# EAGLE schematic RMCPPS1 (EAGLE 7.5.0)
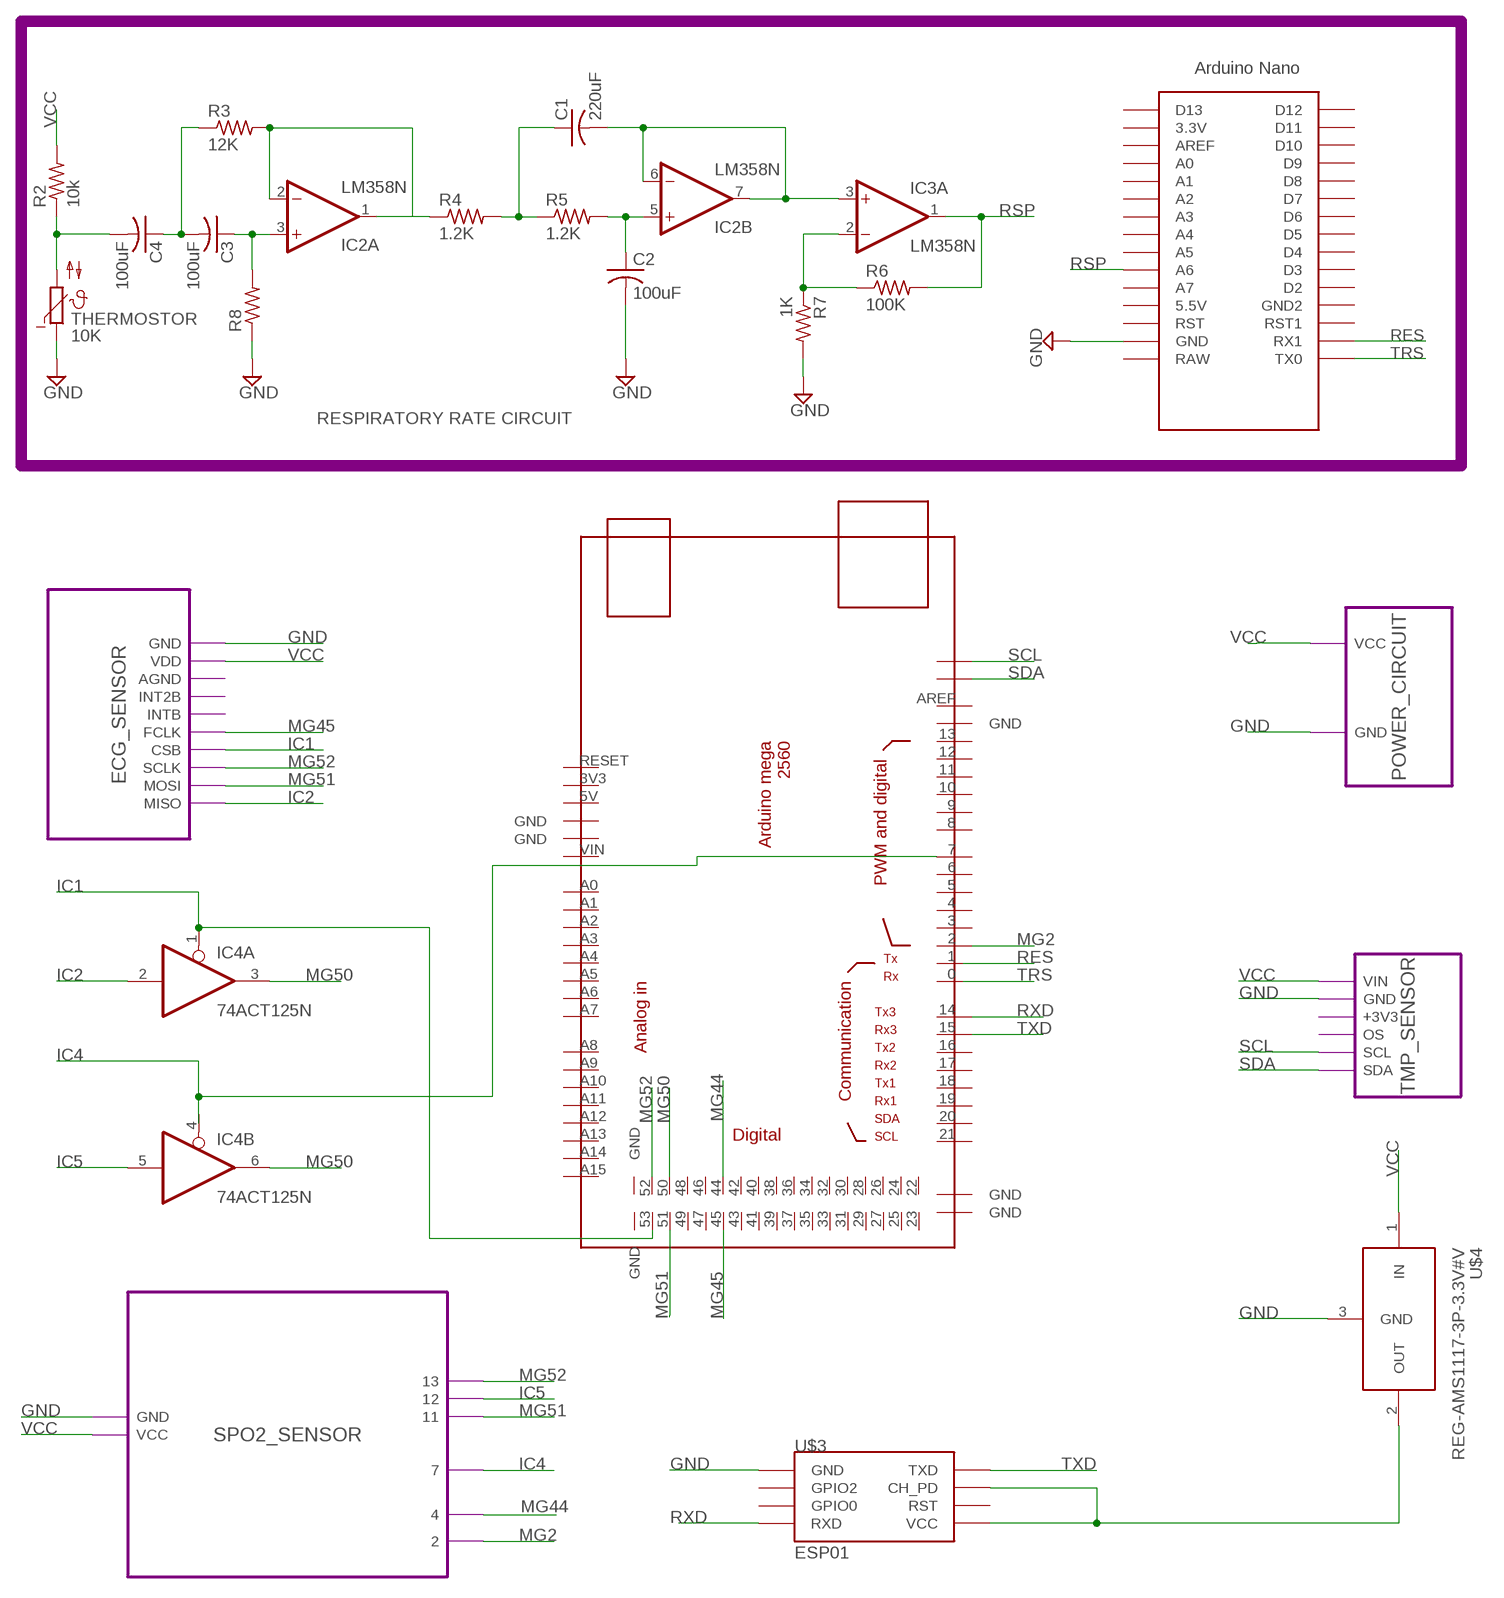
[diagram p0: schematic, sheet 1]

## Parts
C1  220uF  C-US050-024X044  [C050-024X044]
C2  100uF  C-US050-024X044  [C050-024X044]
C3  100uF  C-US050-024X044  [C050-024X044]
C4  100uF  C-US050-024X044  [C050-024X044]
IC2  LM358N  [DIL08]
IC3  LM358N  [DIL08]
IC4  74ACT125N  [DIL14]
R2  10k  R-US_0204/7  [0204/7]
R3  12K  R-US_0204/7  [0204/7]
R4  1.2K  R-US_0204/7  [0204/7]
R5  1.2K  R-US_0204/7  [0204/7]
R6  100K  R-US_0204/7  [0204/7]
R7  1K  R-US_0204/7  [0204/7]
R8  R-US_0204/7  [0204/7]
THERMOSTOR  10K  NTC640-9  [N640]
U$1  NANO  [NANO]
U$2  MEGA_DEVICE  [MEGAOUTLINE]
U$3  ESP01  [ESP01]
U$4  REG-AMS1117-3P-3.3V#V  [REG-AMS1117-3P#V]

## Module instances
ECG_SENSOR = ECG_SENSOR
TMP_SENSOR = TMP_SENSOR
SPO2_SENSOR = SPO2_SENSOR
POWER_CIRCUIT = POWER_CIRCUIT

## Nets
GND: C2.2 R7.2 R8.1 THERMOSTOR.1 U$1.GND U$3.GND U$4.3(GND) ; port TMP_SENSOR.GND POWER_CIRCUIT.GND SPO2_SENSOR.GND
IC1: IC4.1(A:OE)
IC2: IC4.2(A:I) ; port ECG_SENSOR.MISO
IC4: U$2.7 ; port SPO2_SENSOR.7
IC5: IC4.5(B:I) ; port SPO2_SENSOR.12
MG2: port SPO2_SENSOR.2
MG44: port SPO2_SENSOR.4
MG50: IC4.3(A:O) IC4.6(B:O)
MG51: port ECG_SENSOR.MOSI SPO2_SENSOR.11
MG52: port SPO2_SENSOR.13
N$1: C4.2 R2.1 THERMOSTOR.2
N$2: C3.2 C4.1 R3.1
N$3: C3.1 IC2.3(A:+IN) R8.2
N$4: IC2.1(A:OUT) R4.1
N$5: IC2.2(A:-IN) R3.2
N$6: IC3.2(A:-IN) R6.1 R7.1
N$8: C1.1 R4.2 R5.1
N$9: C2.1 IC2.5(B:+IN) R5.2
N$10: C1.2 IC2.6(B:-IN) IC2.7(B:OUT) IC3.3(A:+IN)
N$12: U$3.CH_PD U$3.VCC U$4.2(OUT)
RES: U$1.RX1
RSP: R6.2 U$1.A6
RXD: U$3.RX(RXD)
SCL: port TMP_SENSOR.SCL
SDA: port TMP_SENSOR.SDA
TRS: U$1.TX0
TXD: U$3.TX(TXD)
VCC: R2.2 U$4.1(IN) ; port TMP_SENSOR.VIN POWER_CIRCUIT.VCC SPO2_SENSOR.VCC
Unconnected: IC3.1(A:OUT) IC3.5(B:+IN) IC3.6(B:-IN) IC3.7(B:OUT) IC4.4(B:OE) IC4.8(C:O) IC4.9(C:I) IC4.10(C:OE) IC4.11(D:O) IC4.12(D:I) IC4.13(D:OE) U$1.3.3V U$1.5V(5.5V) U$1.A0 U$1.A1 U$1.A2 U$1.A3 U$1.A4 U$1.A5 U$1.A7 U$1.AREF U$1.D2 U$1.D3 U$1.D4 U$1.D5 U$1.D6 U$1.D7 U$1.D8 U$1.D9 U$1.D10 U$1.D11 U$1.D12 U$1.D13 U$1.GND1(GND2) U$1.ICSP1 U$1.ICSP2 U$1.ICSP3 U$1.ICSP4 U$1.ICSP5 U$1.ICSP6 U$1.RAW U$1.RST U$1.RST1 U$2.0 U$2.1 U$2.2 U$2.3 U$2.3V3 U$2.4 U$2.5 U$2.5V U$2.6 U$2.8 U$2.9 U$2.10 U$2.11 U$2.12 U$2.13 U$2.14 U$2.15 U$2.16 U$2.17 U$2.18 U$2.19 U$2.20 U$2.21 U$2.22 U$2.23 U$2.24 U$2.25 U$2.26 U$2.27 U$2.28 U$2.29 U$2.30 U$2.31 U$2.32 U$2.33 U$2.34 U$2.35 U$2.36 U$2.37 U$2.38 U$2.39 U$2.40 U$2.41 U$2.42 U$2.43 U$2.44 U$2.45 U$2.46 U$2.47 U$2.48 U$2.49 U$2.50 U$2.51 U$2.52 U$2.53 U$2.A0 U$2.A1 U$2.A2 U$2.A3 U$2.A4 U$2.A5 U$2.A6 U$2.A7 U$2.A8 U$2.A9 U$2.A10 U$2.A11 U$2.A12 U$2.A13 U$2.A14 U$2.A15 U$2.AREF U$2.GND@1(GND) U$2.GND@2(GND) U$2.GND@3(GND) U$2.GND@4(GND) U$2.GND@5(GND) U$2.GND@6(GND) U$2.GND@7(GND) U$2.RESET U$2.VIN U$3.GPIO0 U$3.GPIO2 U$3.RST

## Notes on the sheet
- RESPIRATORY RATE CIRCUIT

## Power pins joined to a net without a drawn wire
GND: IC4.7(P:GND)
V+: IC2.8(P:V+) IC3.8(P:V+)
V-: IC2.4(P:V-) IC3.4(P:V-)
VCC: IC4.14(P:VCC)

## Library data of the parts
C1-C4 = adafruit:C-US: CAPACITOR, American symbol
IC2 IC3 = linear:LM358: OP AMP also LM158; LM258; LM2904 Source: http://cache.national.com/ds/LM/LM158.pdf
IC4 = 74xx-eu:74*125: Quad bus BUFFER, 3-state
R2-R8 = adafruit:R-US_: RESISTOR, American symbol
THERMOSTOR = ptc-ntc:NTC640-9: PHILIPS NTC; OC_FARNELL: unknown; OC_NEWARK: unknown
U$1 = Arduino-clone:NANO: Arduino Nano
U$2 = ArduinoMegaOutline:MEGA_DEVICE: mega card as device
U$3 = esp8266modules:ESP01: ESP8266 Wifi module 01
U$4 = diy-modules:REG-AMS1117-3P-*: Linear Regulator based on AMS1117 chip 3-pin version AMS1117 datasheet is available here: http://www.advanced-monolithic.com/pdf/ds1117.pdf Click here to find device on ebay.com <http://www.ebay.com/sch/ams1117+module> Note: There are many variants. Search for the proper version.

## Module ECG_SENSOR
Ports: GND(io) VDD(io) AGND(io) INT2B(io) INTB(io) FCLK(io) CSB(io) SCLK(io) MOSI(io) MISO(io)
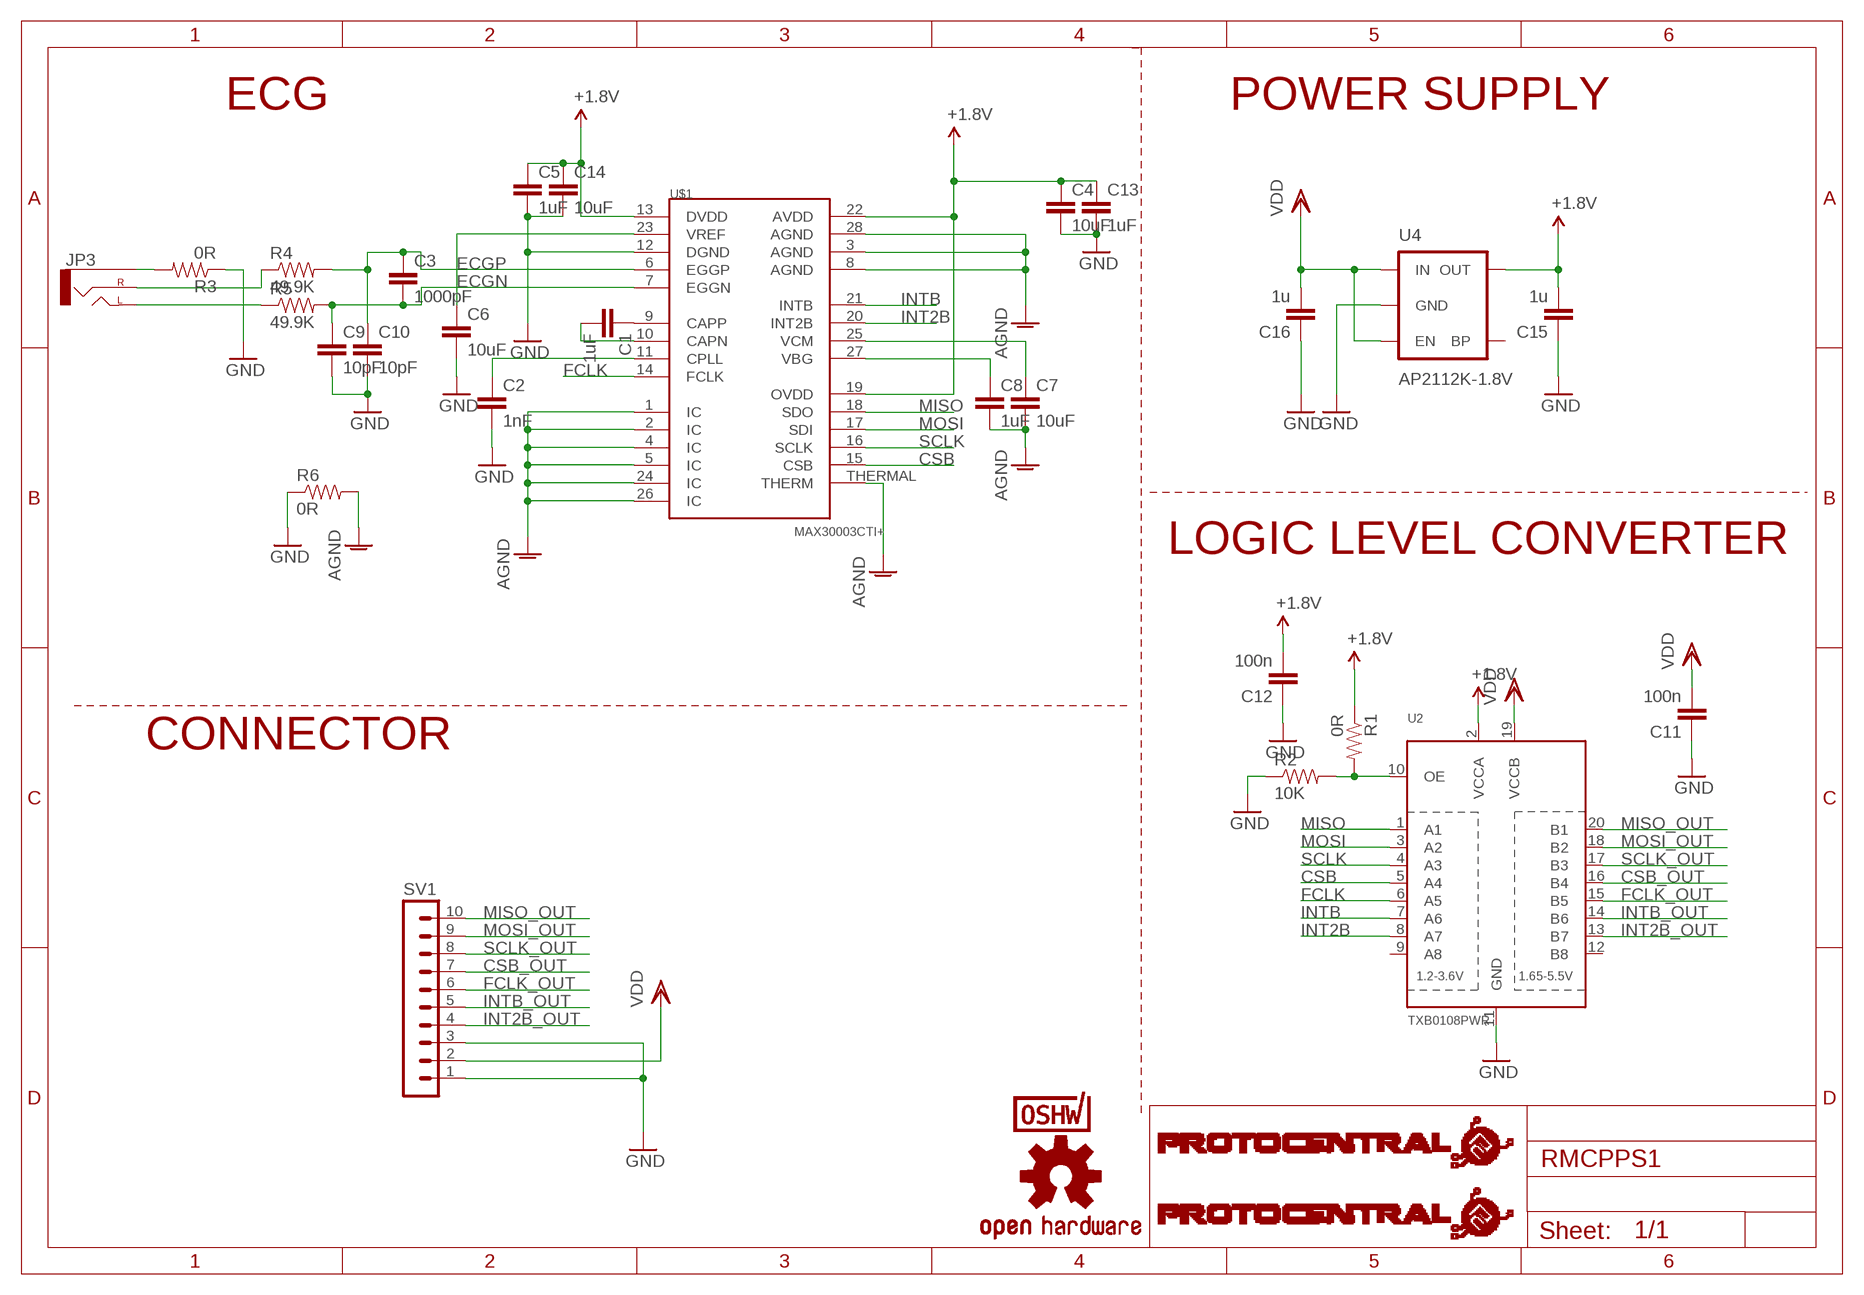
[diagram p1: schematic, module ECG_SENSOR, sheet 1]

### Parts
C1  1uF  C-EUC0805  [C0805]
C2  1nF  C-EUC0805  [C0805]
C3  1000pF  C-EUC0402  [C0402]
C4  10uF  C-EUC0805  [C0805]
C5  1uF  C-EUC0805  [C0805]
C6  10uF  C-EUC0805  [C0805]
C7  10uF  C-EUC0805  [C0805]
C8  1uF  C-EUC0805  [C0805]
C9  10pF  C-EUC0402  [C0402]
C10  10pF  C-EUC0402  [C0402]
C11  100n  C-EUC0402  [C0402]
C12  100n  C-EUC0402  [C0402]
C13  1uF  C-EUC0805  [C0805]
C14  10uF  C-EUC0805  [C0805]
C15  1u  C-EUC0805  [C0805]
C16  1u  C-EUC0805  [C0805]
JP3  AUDIO-JACKSMD2  [AUDIO-JACK-3.5MM-SMD]
R1  0R  RESISTOR0805-RES  [0805]
R2  10K  RESISTOR0805-RES  [0805]
R3  0R  RESISTOR0805-RES  [0805]
R4  49.9K  RESISTOR0805-RES  [0805]
R5  49.9K  RESISTOR0805-RES  [0805]
R6  0R  RESISTOR0805-RES  [0805]
SV1  MA10-1  [MA10-1]
U2  TXB0108PWR  [TSSOP20]
U4  AP2112K-1.8V  V_REG_LDOSMD  [SOT23-5]
U$1  MAX30003CTI+  MAX30003  [QFN-28]
U$2  PROTY_LOGO_WITH_TEXT  [PROTY_WITH_TEXT]
U$3  PROTY-LOGO  [LOGO-PROTY]
U$6  OSHW-LOGOS  [OSHW-LOGO-S]
U$7  CERT-SMALL  [CERT-SMALL-SILK]

### Nets
+1.8V: C4.1 C5.1 C12.2 C13.1 C14.1 C15.2 R1.1 U2.2(VCCA) U4.5(OUT) U$1.13(DVDD) U$1.19(OVDD) U$1.22(AVDD)
AGND: C7.2 C8.2 R6.2 U$1.1(IC) U$1.2(IC) U$1.3(AGND) U$1.4(IC) U$1.5(IC) U$1.8(AGND) U$1.24(IC) U$1.26(IC) U$1.28(AGND) U$1.THERMAL(THERM)
CSB: U2.5(A4) U$1.15(CSB)
CSB_OUT: SV1.7 U2.16(B4)
ECGN: C3.2 C9.1 R5.2 U$1.7(EGGN)
ECGP: C3.1 C10.1 R4.2 U$1.6(EGGP)
FCLK: U2.6(A5) U$1.14(FCLK)
FCLK_OUT: SV1.6 U2.15(B5)
GND: C2.2 C4.2 C5.2 C6.2 C9.2 C10.2 C11.1 C12.1 C13.2 C14.2 C15.1 C16.1 R2.1 R3.1 R6.1 SV1.1 SV1.3 U2.11(GND) U4.2(GND) U$1.12(DGND)
INT2B: U2.8(A7) U$1.20(INT2B)
INT2B_OUT: SV1.4 U2.13(B7)
INTB: U2.7(A6) U$1.21(INTB)
INTB_OUT: SV1.5 U2.14(B6)
MISO: U2.1(A1) U$1.18(SDO)
MISO_OUT: SV1.10 U2.20(B1)
MOSI: U2.3(A2) U$1.17(SDI)
MOSI_OUT: SV1.9 U2.18(B2)
N$1: R1.2 R2.2 U2.10(OE)
N$2: C6.1 U$1.23(VREF)
N$3: C1.1 U$1.9(CAPP)
N$4: JP3.SLEEVE R3.2
N$6: C1.2 U$1.10(CAPN)
N$7: C2.1 U$1.11(CPLL)
N$9: JP3.TIP(LEFT) R5.1
N$10: JP3.RING(RIGHT) R4.1
N$13: C7.1 U$1.25(VCM)
N$14: C8.1 U$1.27(VBG)
SCLK: U2.4(A3) U$1.16(SCLK)
SCLK_OUT: SV1.8 U2.17(B3)
VDD: C11.2 C16.2 SV1.2 U2.19(VCCB) U4.1(IN) U4.3(EN)
Unconnected: U2.9(A8) U2.12(B8) U4.4(BP)

### Notes on the sheet
- ECG | POWER SUPPLY
- LOGIC LEVEL CONVERTER
- CONNECTOR

### Library data of the parts
C1-C16 = rcl:C-EU: CAPACITOR, European symbol
JP3 = SparkFun-Connectors:AUDIO-JACK: 3.5mm Audio Jack Simple 3.5mm common PCB mount audio jack. SKU: PRT-08032; PROD_ID: CONN-10353
R1-R6 = SparkFun:RESISTOR: Resistor Basic schematic elements and footprints for 0603, 1206, and PTH resistors.
SV1 = con-lstb:MA10-1: PIN HEADER; OC_FARNELL: unknown; OC_NEWARK: unknown
U2 = adafruit:TXB0108PWR: 8-Bit Bi-Directional Level Shifter 1.2V-3.6V (VCCA) to 1.65V-5.5V (VCCB) bi-directional level shifter with auto direction sensing. Max data rate - VCCA 1.8V: 20Mbps (50ns), VCCA 3.3V: 100Mbps (10ns) Digikey: 296-21527-1-ND
U4 = SparkFun-PowerIC:V_REG_LDO: Voltage Regulator LDO Standard 150mA LDO voltage regulator in SOT-23 layout. Micrel part MIC5205. BP (by-pass) pin is used to lower output noise with 470pF cap.; PROD_ID: VREG-12457
U$1 = circuitects:MAX30003
U$2 = circuitects:PROTY_LOGO_WITH_TEXT
U$3 = circuitects:PROTY-LOGO
U$6 = SparkFun:OSHW-LOGO: Open Source Hardware Logo This logo indicates the piece of hardware it is found on incorporates a OSHW license and/or adheres to the definition of open source hardware found here: http://freedomdefined.org/OSHW
U$7 = OSHWA:CERT

## Module TMP_SENSOR
Ports: VIN(io) GND(io) +3V3(io) OS(io) SCL(io) SDA(io)
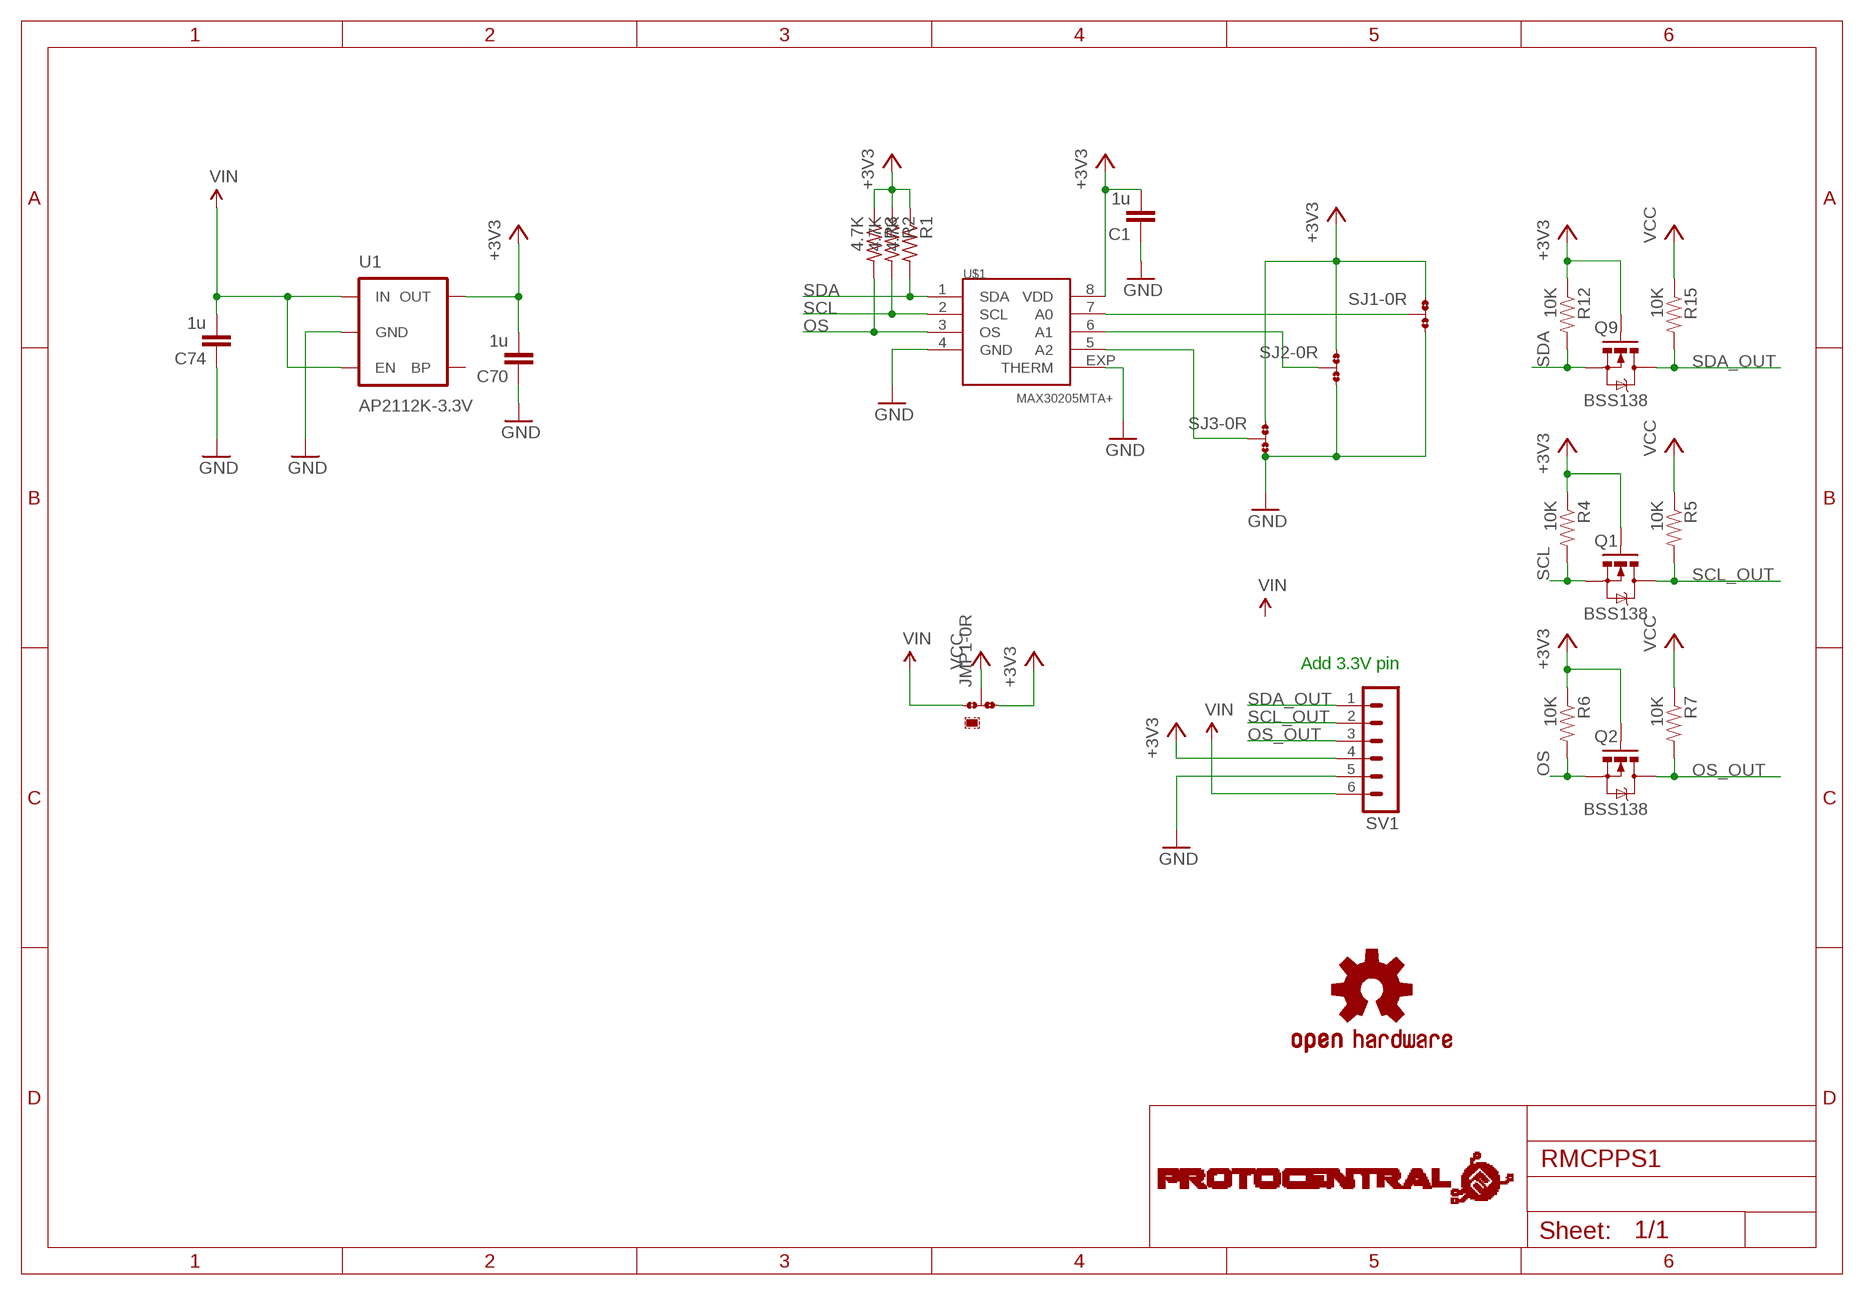
[diagram p2: schematic, module TMP_SENSOR, sheet 1]

### Parts
C1  1u  C-EUC0805  [C0805]
C70  1u  C-EUC0805  [C0805]
C74  1u  C-EUC0805  [C0805]
JMP1  0R-JUMPA  [A0R-JMP-0402]
Q1  BSS138  MOSFET-NCHANNELSMD  [SOT23-3]
Q2  BSS138  MOSFET-NCHANNELSMD  [SOT23-3]
Q9  BSS138  MOSFET-NCHANNELSMD  [SOT23-3]
R1  4.7K  R-US_R0402  [R0402]
R2  4.7K  R-US_R0402  [R0402]
R3  4.7K  R-US_R0402  [R0402]
R4  10K  RESISTOR0805-RES  [0805]
R5  10K  RESISTOR0805-RES  [0805]
R6  10K  RESISTOR0805-RES  [0805]
R7  10K  RESISTOR0805-RES  [0805]
R12  10K  RESISTOR0805-RES  [0805]
R15  10K  RESISTOR0805-RES  [0805]
SJ1  0R-JUMPA  [A0R-JMP-0402]
SJ2  0R-JUMPA  [A0R-JMP-0402]
SJ3  0R-JUMPA  [A0R-JMP-0402]
SV1  MA06-1  [MA06-1]
U1  AP2112K-3.3V  V_REG_LDOSMD  [SOT23-5]
U$1  MAX30205MTA+  [TDFN-08]
U$5  PROTY-LOGO  [LOGO-PROTY]
U$7  OSHW-LOGOS  [OSHW-LOGO-S]

### Nets
+3V3: C1.2 C70.2 JMP1.3 Q1.1(G) Q2.1(G) Q9.1(G) R1.1 R2.1 R3.1 R4.1 R6.1 R12.1 SJ1.1 SJ2.1 SJ3.1 SV1.4 U1.5(OUT) U$1.8(VDD)
A0: SJ1.2 U$1.7(A0)
A1: SJ2.2 U$1.6(A1)
A2: SJ3.2 U$1.5(A2)
GND [gnd]: C1.1 C70.1 C74.1 SJ1.3 SJ2.3 SJ3.3 SV1.5 U1.2(GND) U$1.4(GND) U$1.EXP(THERM)
OS: Q2.2(S) R3.2 R6.2 U$1.3(OS)
OS_OUT: Q2.3(D) R7.2 SV1.3
SCL: Q1.2(S) R2.2 R4.2 U$1.2(SCL)
SCL_OUT: Q1.3(D) R5.2 SV1.2
SDA: Q9.2(S) R1.2 R12.2 U$1.1(SDA)
SDA_OUT: Q9.3(D) R15.2 SV1.1
VCC: JMP1.2 R5.1 R7.1 R15.1
VIN: C74.2 JMP1.1 SV1.6 U1.1(IN) U1.3(EN)
Unconnected: U1.4(BP)

### Notes on the sheet
- Add 3.3V pin

### Library data of the parts
C1 C70 C74 = rcl:C-EU: CAPACITOR, European symbol
JMP1 SJ1-SJ3 = circuitects:0R-JUMP: SMD 0R 0402 Jumper
Q1 Q2 Q9 = SparkFun:MOSFET-NCHANNEL
R1-R3 = rcl:R-US_: RESISTOR, American symbol
R4-R7 R12 R15 = SparkFun:RESISTOR: Resistor Basic schematic elements and footprints for 0603, 1206, and PTH resistors.
SV1 = con-lstb:MA06-1: PIN HEADER; OC_FARNELL: unknown; OC_NEWARK: unknown
U1 = SparkFun-PowerIC:V_REG_LDO: Voltage Regulator LDO Standard 150mA LDO voltage regulator in SOT-23 layout. Micrel part MIC5205. BP (by-pass) pin is used to lower output noise with 470pF cap.; PROD_ID: VREG-12457
U$1 = circuitects:MAX30205
U$5 = circuitects:PROTY-LOGO
U$7 = SparkFun:OSHW-LOGO: Open Source Hardware Logo This logo indicates the piece of hardware it is found on incorporates a OSHW license and/or adheres to the definition of open source hardware found here: http://freedomdefined.org/OSHW

## Module SPO2_SENSOR
Ports: GND(io) VCC(io) 2(io) 7(io) 11(io) 12(io) 13(io) 4(io)
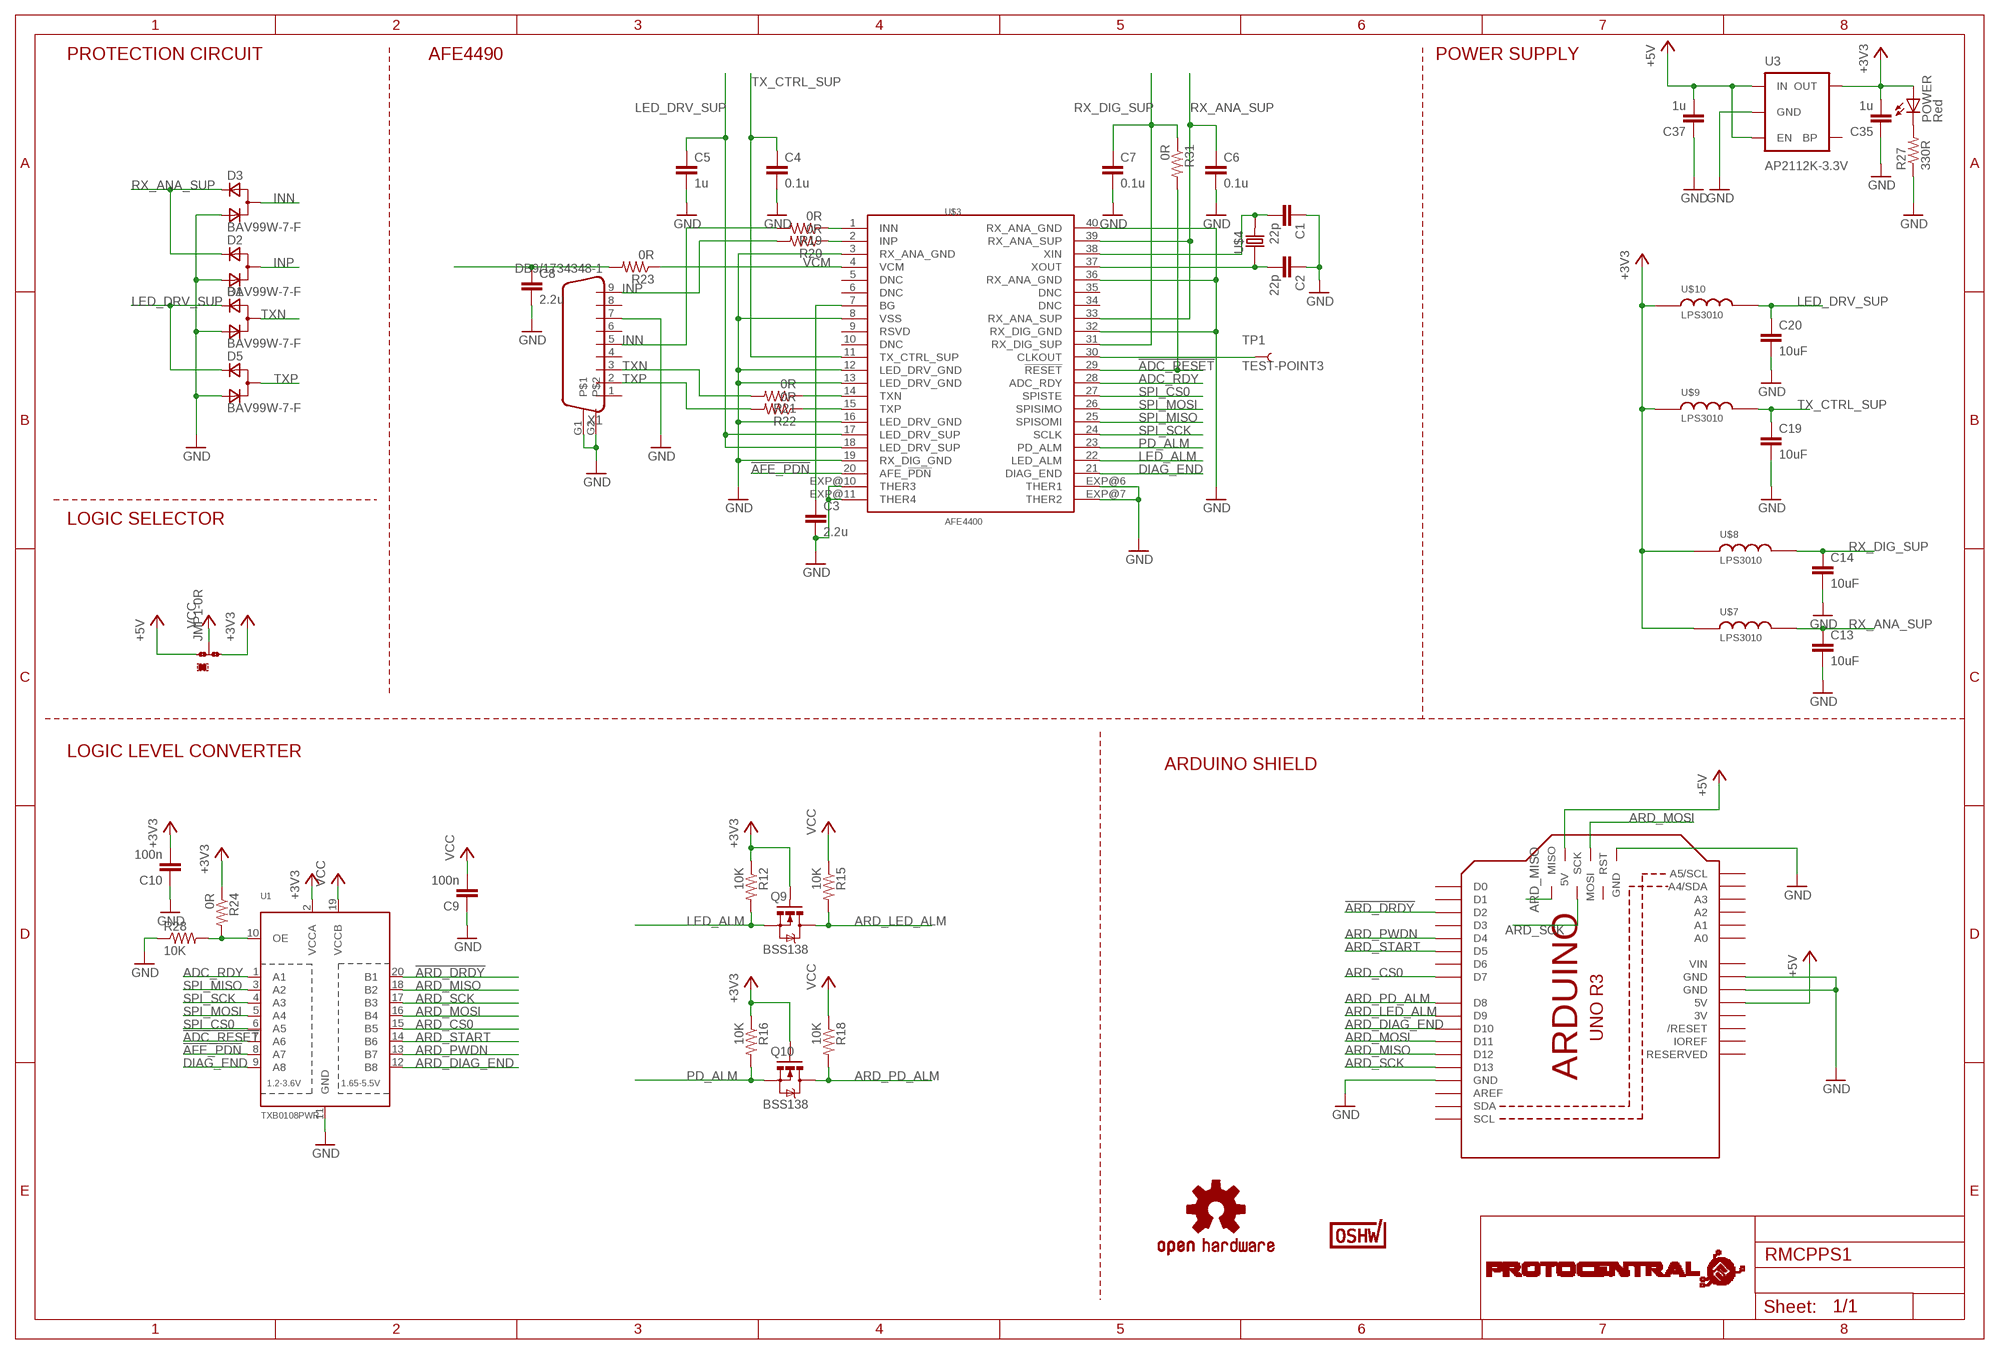
[diagram p3: schematic, module SPO2_SENSOR, sheet 1]

### Parts
C1  22p  C-EUC0402  [C0402]
C2  22p  C-EUC0402  [C0402]
C3  2.2u  C-EUC0402  [C0402]
C4  0.1u  C-EUC0805  [C0805]
C5  1u  C-EUC0805  [C0805]
C6  0.1u  C-EUC0805  [C0805]
C7  0.1u  C-EUC0805  [C0805]
C8  2.2u  C-EUC0402  [C0402]
C9  100n  C-EUC0402  [C0402]
C10  100n  C-EUC0402  [C0402]
C13  10uF  C-EUC0805  [C0805]
C14  10uF  C-EUC0805  [C0805]
C19  10uF  C-EUC0805  [C0805]
C20  10uF  C-EUC0805  [C0805]
C35  1u  C-EUC0805  [C0805]
C37  1u  C-EUC0805  [C0805]
D1  BAV99W-7-F  D_ACACSOT323  [SOT323]
D2  BAV99W-7-F  D_ACACSOT323  [SOT323]
D3  BAV99W-7-F  D_ACACSOT323  [SOT323]
D5  BAV99W-7-F  D_ACACSOT323  [SOT323]
JMP1  0R-JUMPA  [A0R-JMP]
M1  ARDUINO  [ARDUINO]
POWER  Red  LEDCHIPLED_0603  [CHIPLED_0603]
Q9  BSS138  MOSFET-NCHANNELSMD  [SOT23-3]
Q10  BSS138  MOSFET-NCHANNELSMD  [SOT23-3]
R12  10K  RESISTOR0805-RES  [0805]
R15  10K  RESISTOR0805-RES  [0805]
R16  10K  RESISTOR0805-RES  [0805]
R18  10K  RESISTOR0805-RES  [0805]
R19  0R  R-US_R0402  [R0402]
R20  0R  R-US_R0402  [R0402]
R21  0R  R-US_R0805  [R0805]
R22  0R  R-US_R0805  [R0805]
R23  0R  R-US_R0402  [R0402]
R24  0R  RESISTOR0805-RES  [0805]
R27  330R  R-US_R0805  [R0805]
R28  10K  RESISTOR0805-RES  [0805]
R31  0R  R-US_R0805  [R0805]
TP1  TEST-POINT3  [PAD.03X.03]
U1  TXB0108PWR  [TSSOP20]
U3  AP2112K-3.3V  V_REG_LDOSMD  [SOT23-5]
U$3  AFE4400  [QFN-40]
U$4  ABM3  [ABM3]
U$5  PROTY_LOGO_WITH_TEXT  [PROTY_WITH_TEXT]
U$6  CERT-SMALL  [CERT-SMALL-SILK]
U$7  LPS3010  LPS  [LPS]
U$8  LPS3010  LPS  [LPS]
U$9  LPS3010  LPS  [LPS]
U$10  LPS3010  LPS  [LPS]
U$11  OSHW-LOGOM  [OSHW-LOGO-M]
X1  DB9/1734348-1  DB9  [DB9]

### Nets
!ADC_RESET: R31.2 U1.7(A6) U$3.29(!RESET)
!AFE_PDN: U1.8(A7) U$3.20(AFE_!PDN)
!ARD_DRDY: M1.D2 U1.20(B1)
+3V3: C10.2 C35.2 JMP1.3 POWER.A Q9.1(G) Q10.1(G) R12.1 R16.1 R24.1 U1.2(VCCA) U3.5(OUT) U$7.1 U$8.1 U$9.1 U$10.1
+5V: C37.2 JMP1.1 M1.5V M1.5V_ICSP(5V) U3.1(IN) U3.3(EN)
ADC_RDY: U1.1(A1) U$3.28(ADC_RDY)
ARD_CS0: M1.D7 U1.15(B5)
ARD_DIAG_END: M1.D10 U1.12(B8)
ARD_LED_ALM: M1.D9 Q9.3(D) R15.2
ARD_MISO: M1.D12 M1.MISO U1.18(B2)
ARD_MOSI: M1.D11 M1.MOSI U1.16(B4)
ARD_PD_ALM: M1.D8 Q10.3(D) R18.2
ARD_PWDN: M1.D4 U1.13(B7)
ARD_SCK: M1.D13 M1.SCK U1.17(B3)
ARD_START: M1.D5 U1.14(B6)
DIAG_END: U1.9(A8) U$3.21(DIAG_END)
GND: C1.1 C2.1 C3.2 C4.2 C5.2 C6.2 C7.2 C8.2 C9.1 C10.1 C13.2 C14.2 C19.2 C20.2 C35.1 C37.1 D1.2(C) D2.2(C) D3.2(C) D5.2(C) M1.GND M1.GND@1(GND) M1.GND@2(GND) M1.GND@3(GND) R27.1 R28.1 U1.11(GND) U3.2(GND) U$3.3(RX_ANA_GND) U$3.8(VSS) U$3.12(LED_DRV_GND) U$3.13(LED_DRV_GND) U$3.16(LED_DRV_GND) U$3.19(RX_DIG_GND) U$3.32(RX_DIG_GND) U$3.36(RX_ANA_GND) U$3.40(RX_ANA_GND) U$3.EXP@6(THER1) U$3.EXP@7(THER2) U$3.EXP@10(THER3) U$3.EXP@11(THER4) X1.7 X1.G1 X1.G2
INN: D3.1(CA) R19.2 X1.5
INP: D2.1(CA) R20.2 X1.9
LED_ALM: Q9.2(S) R12.2 U$3.22(LED_ALM)
LED_DRV_SUP: C5.1 C20.1 D1.3(A) D5.3(A) U$3.17(LED_DRV_SUP) U$3.18(LED_DRV_SUP) U$10.2
N$2: C3.1 U$3.7(BG)
N$4: R21.1 U$3.14(TXN)
N$5: TP1.P$1 U$3.30(CLKOUT)
N$6: R22.1 U$3.15(TXP)
N$7: POWER.C R27.2
N$8: R19.1 U$3.1(INN)
N$9: C8.1 R23.2
N$10: C1.2 U$3.38(XIN) U$4.2
N$11: C2.2 U$3.37(XOUT) U$4.1
N$12: R24.2 R28.2 U1.10(OE)
N$17: R20.1 U$3.2(INP)
PD_ALM: Q10.2(S) R16.2 U$3.23(PD_ALM)
RX_ANA_SUP: C6.1 C13.1 D2.3(A) D3.3(A) U$3.33(RX_ANA_SUP) U$3.39(RX_ANA_SUP) U$7.2
RX_DIG_SUP: C7.1 C14.1 R31.1 U$3.31(RX_DIG_SUP) U$8.2
SPI_CS0: U1.6(A5) U$3.27(SPISTE)
SPI_MISO: U1.3(A2) U$3.25(SPISOMI)
SPI_MOSI: U1.5(A4) U$3.26(SPISIMO)
SPI_SCK: U1.4(A3) U$3.24(SCLK)
TX_CTRL_SUP: C4.1 C19.1 U$3.11(TX_CTRL_SUP) U$9.2
TXN: D1.1(CA) R21.2 X1.3
TXP: D5.1(CA) R22.2 X1.2
VCC: C9.2 JMP1.2 R15.1 R18.1 U1.19(VCCB)
VCM: R23.1 U$3.4(VCM)
Unconnected: M1.A0 M1.A1 M1.A2 M1.A3 M1.A4(A4/SDA) M1.A5(A5/SCL) M1.AREF M1.D0 M1.D1 M1.D3 M1.D6 M1.IOREF M1.RESERVED M1.RESET(/RESET) M1.RESET_ICSP(RST) M1.SCL M1.SDA U3.4(BP) U$3.5(DNC) U$3.6(DNC) U$3.9(RSVD) U$3.10(DNC) U$3.34(DNC) U$3.35(DNC) X1.1 X1.4 X1.6 X1.8

### Notes on the sheet
- PROTECTION CIRCUIT | AFE4490 | POWER SUPPLY
- LOGIC SELECTOR
- LOGIC LEVEL CONVERTER
- ARDUINO SHIELD

### Power pins joined to a net without a drawn wire
3V: M1.3V
VIN: M1.VIN

### Library data of the parts
C1-C10 C13 C14 C19 C20 C35 C37 = rcl:C-EU: CAPACITOR, European symbol
D1-D3 D5 = zetex:D_ACAC: Dual DIODE; OC_FARNELL: unknown; OC_NEWARK: unknown
JMP1 = jump-0r-smd:0R-JUMP: SMD 0R 0805 Jumper
M1 = circuitects:ARDUINO
POWER = led:LED: LED
Q9 Q10 = SparkFun:MOSFET-NCHANNEL
R12 R15 R16 R18 R24 R28 = SparkFun:RESISTOR: Resistor Basic schematic elements and footprints for 0603, 1206, and PTH resistors.
R19-R23 R27 R31 = rcl:R-US_: RESISTOR, American symbol
TP1 = SparkFun:TEST-POINT
U1 = adafruit:TXB0108PWR: 8-Bit Bi-Directional Level Shifter 1.2V-3.6V (VCCA) to 1.65V-5.5V (VCCB) bi-directional level shifter with auto direction sensing. Max data rate - VCCA 1.8V: 20Mbps (50ns), VCCA 3.3V: 100Mbps (10ns) Digikey: 296-21527-1-ND
U3 = SparkFun-PowerIC:V_REG_LDO: Voltage Regulator LDO Standard 150mA LDO voltage regulator in SOT-23 layout. Micrel part MIC5205. BP (by-pass) pin is used to lower output noise with 470pF cap.; PROD_ID: VREG-12457
U$3 = circuitects:AFE4400
U$4 = circuitects:ABM3
U$5 = circuitects:PROTY_LOGO_WITH_TEXT
U$6 = OSHWA:CERT
U$7-U$10 = circuitects:LPS
U$11 = SparkFun:OSHW-LOGO: Open Source Hardware Logo This logo indicates the piece of hardware it is found on incorporates a OSHW license and/or adheres to the definition of open source hardware found here: http://freedomdefined.org/OSHW
X1 = circuitects:DB9: DB9 Connector Standard DB9 (D-Sub 9) serial connector. Can be used for CAN bus as well as RS485 and RS232. Footprint production proven. Spark Fun Electronics SKU : PRT-00429

## Module POWER_CIRCUIT
Ports: VCC(io) GND(io)
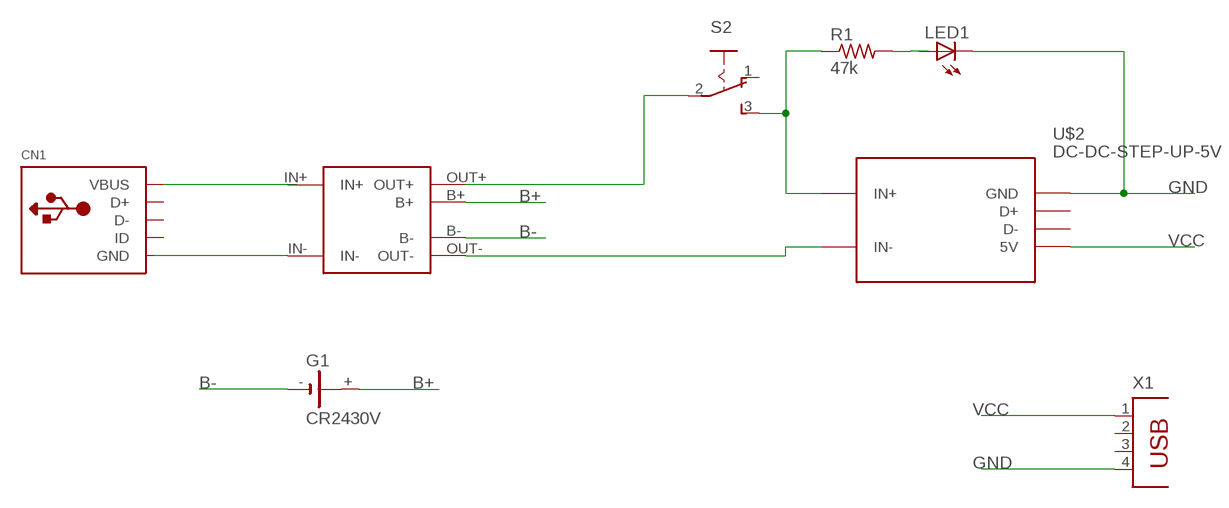
[diagram p4: schematic, module POWER_CIRCUIT, sheet 1]

### Parts
CN1  USBMOLEX  [USB-MINIB-THM-MOLEX]
G1  CR2430V  [CR2430V]
LED1  LED  [SMARTLED-TTW]
R1  47k  R-US_0207/10  [0207/10]
S2  255SB  [255SB]
U$1  TP4056-MODULE  [TP4056-LITHIUM-PROTECTED-MODULE]
U$2  DC-DC-STEP-UP-5V  [DC-DC-STEP-UP-5V]
X1  PN61729  [PN61729]

### Nets
B+: G1.+ U$1.B+
B-: G1.- U$1.B-
GND: LED1.C@1(C) U$2.GND X1.4
N$1: S2.2(P) U$1.OUT+
N$2: R1.1 S2.3(S) U$2.IN+
N$3: U$1.OUT- U$2.IN-
N$4: U$1.IN-
N$5: R1.2
N$7: CN1.VBUS
VCC: U$2.5V X1.1
Unconnected: CN1.D+ CN1.D- CN1.ID G1.+@1(+) LED1.A@1(A) S2.1(O) U$2.D+ U$2.D- X1.2 X1.3

### Power pins joined to a net without a drawn wire
GND: CN1.GND
IN+: U$1.IN+

### Library data of the parts
CN1 = adafruit:USB: USB Connectors USBMINIB - Surface Mount Female Mini-B USB Connector 4UConnector: 06564 By microbuilder.eu Thru-hole RA Female Mini-B USB Connector 4UConnector: 18732 By ladyada.net
G1 = battery:CR2430V: LI BATTERY Varta
LED1 = adafruit:LED: LED
R1 = adafruit:R-US_: RESISTOR, American symbol
S2 = switch:255SB: SLIDING SWITCH Distributor Buerklin, 11G810
U$1 = userlib:TP4056-MODULE
U$2 = diy-modules:DC-DC-STEP-UP-5V: DC/DC Step-Up Converter
X1 = con-berg:PN61729: BERG USB connector; OC_FARNELL: unknown; OC_NEWARK: unknown

## Net classes
2 gnd: width 0.102 mm, drill 0.1 mm